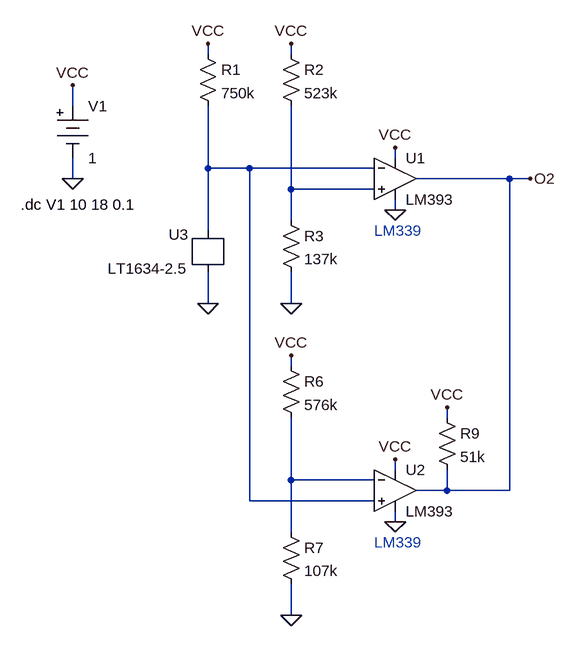
[diagram p0: schematic pwr_good.asc]
pwr_good.asc, the LTspice schematic file:
Version 4
SHEET 1 880 1088
WIRE -64 208 -64 192
WIRE 64 208 64 192
WIRE -272 288 -272 256
WIRE 224 368 224 352
WIRE -64 384 -64 288
WIRE 0 384 -64 384
WIRE 192 384 0 384
WIRE -272 400 -272 368
WIRE 400 400 256 400
WIRE 432 400 400 400
WIRE 64 416 64 288
WIRE 192 416 64 416
WIRE 224 448 224 432
WIRE 64 464 64 416
WIRE -64 480 -64 384
WIRE -64 592 -64 544
WIRE 64 592 64 544
WIRE 64 688 64 672
WIRE 304 768 304 752
WIRE 224 848 224 832
WIRE 64 864 64 768
WIRE 192 864 64 864
WIRE 304 880 304 848
WIRE 304 880 256 880
WIRE 400 880 304 880
WIRE 400 880 400 400
WIRE 0 896 0 384
WIRE 192 896 0 896
WIRE 224 928 224 912
WIRE 64 944 64 864
WIRE 64 1072 64 1024
FLAG 224 448 0
FLAG 224 352 VCC
FLAG -64 592 0
FLAG -64 192 VCC
FLAG -272 400 0
FLAG -272 256 VCC
FLAG 64 592 0
FLAG 64 192 VCC
FLAG 224 928 0
FLAG 224 832 VCC
FLAG 64 1072 0
FLAG 64 672 VCC
FLAG 432 400 O2
FLAG 304 752 VCC
SYMBOL References/LT1634-2.5 -64 512 M0
SYMATTR InstName U3
SYMBOL Res -80 192 R0
SYMATTR InstName R1
SYMATTR Value 750k
SYMBOL Misc/battery -272 272 R0
SYMATTR InstName V1
SYMATTR Value 1
SYMBOL Res 48 192 R0
SYMATTR InstName R2
SYMATTR Value 523k
SYMBOL Res 48 448 R0
SYMATTR InstName R3
SYMATTR Value 137k
SYMBOL ZZZ/Comparator/lm393 224 400 R0
SYMATTR InstName U1
SYMBOL Res 48 672 R0
SYMATTR InstName R6
SYMATTR Value 576k
SYMBOL Res 48 928 R0
SYMATTR InstName R7
SYMATTR Value 107k
SYMBOL ZZZ/Comparator/lm393 224 880 R0
SYMATTR InstName U2
SYMBOL Res 288 752 R0
SYMATTR InstName R9
SYMATTR Value 51k
TEXT -352 440 Left 2 !.dc V1 10 18 0.1
TEXT 192 480 Left 2 ;LM339
TEXT 192 960 Left 2 ;LM339

The netlist it stands for:
* pwr_good.asc
XU3 N001 0 LT1634-2.5
R1 VCC N001 750k
V1 VCC 0 1
R2 VCC N002 523k
R3 N002 0 137k
XU1 N002 N001 VCC 0 O2 LM393  ; pins In+ In- V+ V- OUT
R6 VCC N003 576k
R7 N003 0 107k
XU2 N001 N003 VCC 0 O2 LM393  ; pins In+ In- V+ V- OUT
R9 VCC O2 51k
.dc V1 10 18 0.1
* LM339
* LM339
.backanno
.end